# Altium schematic sheet GD.SchDoc
size A3; SheetNumber: 4; SheetTotal: 4
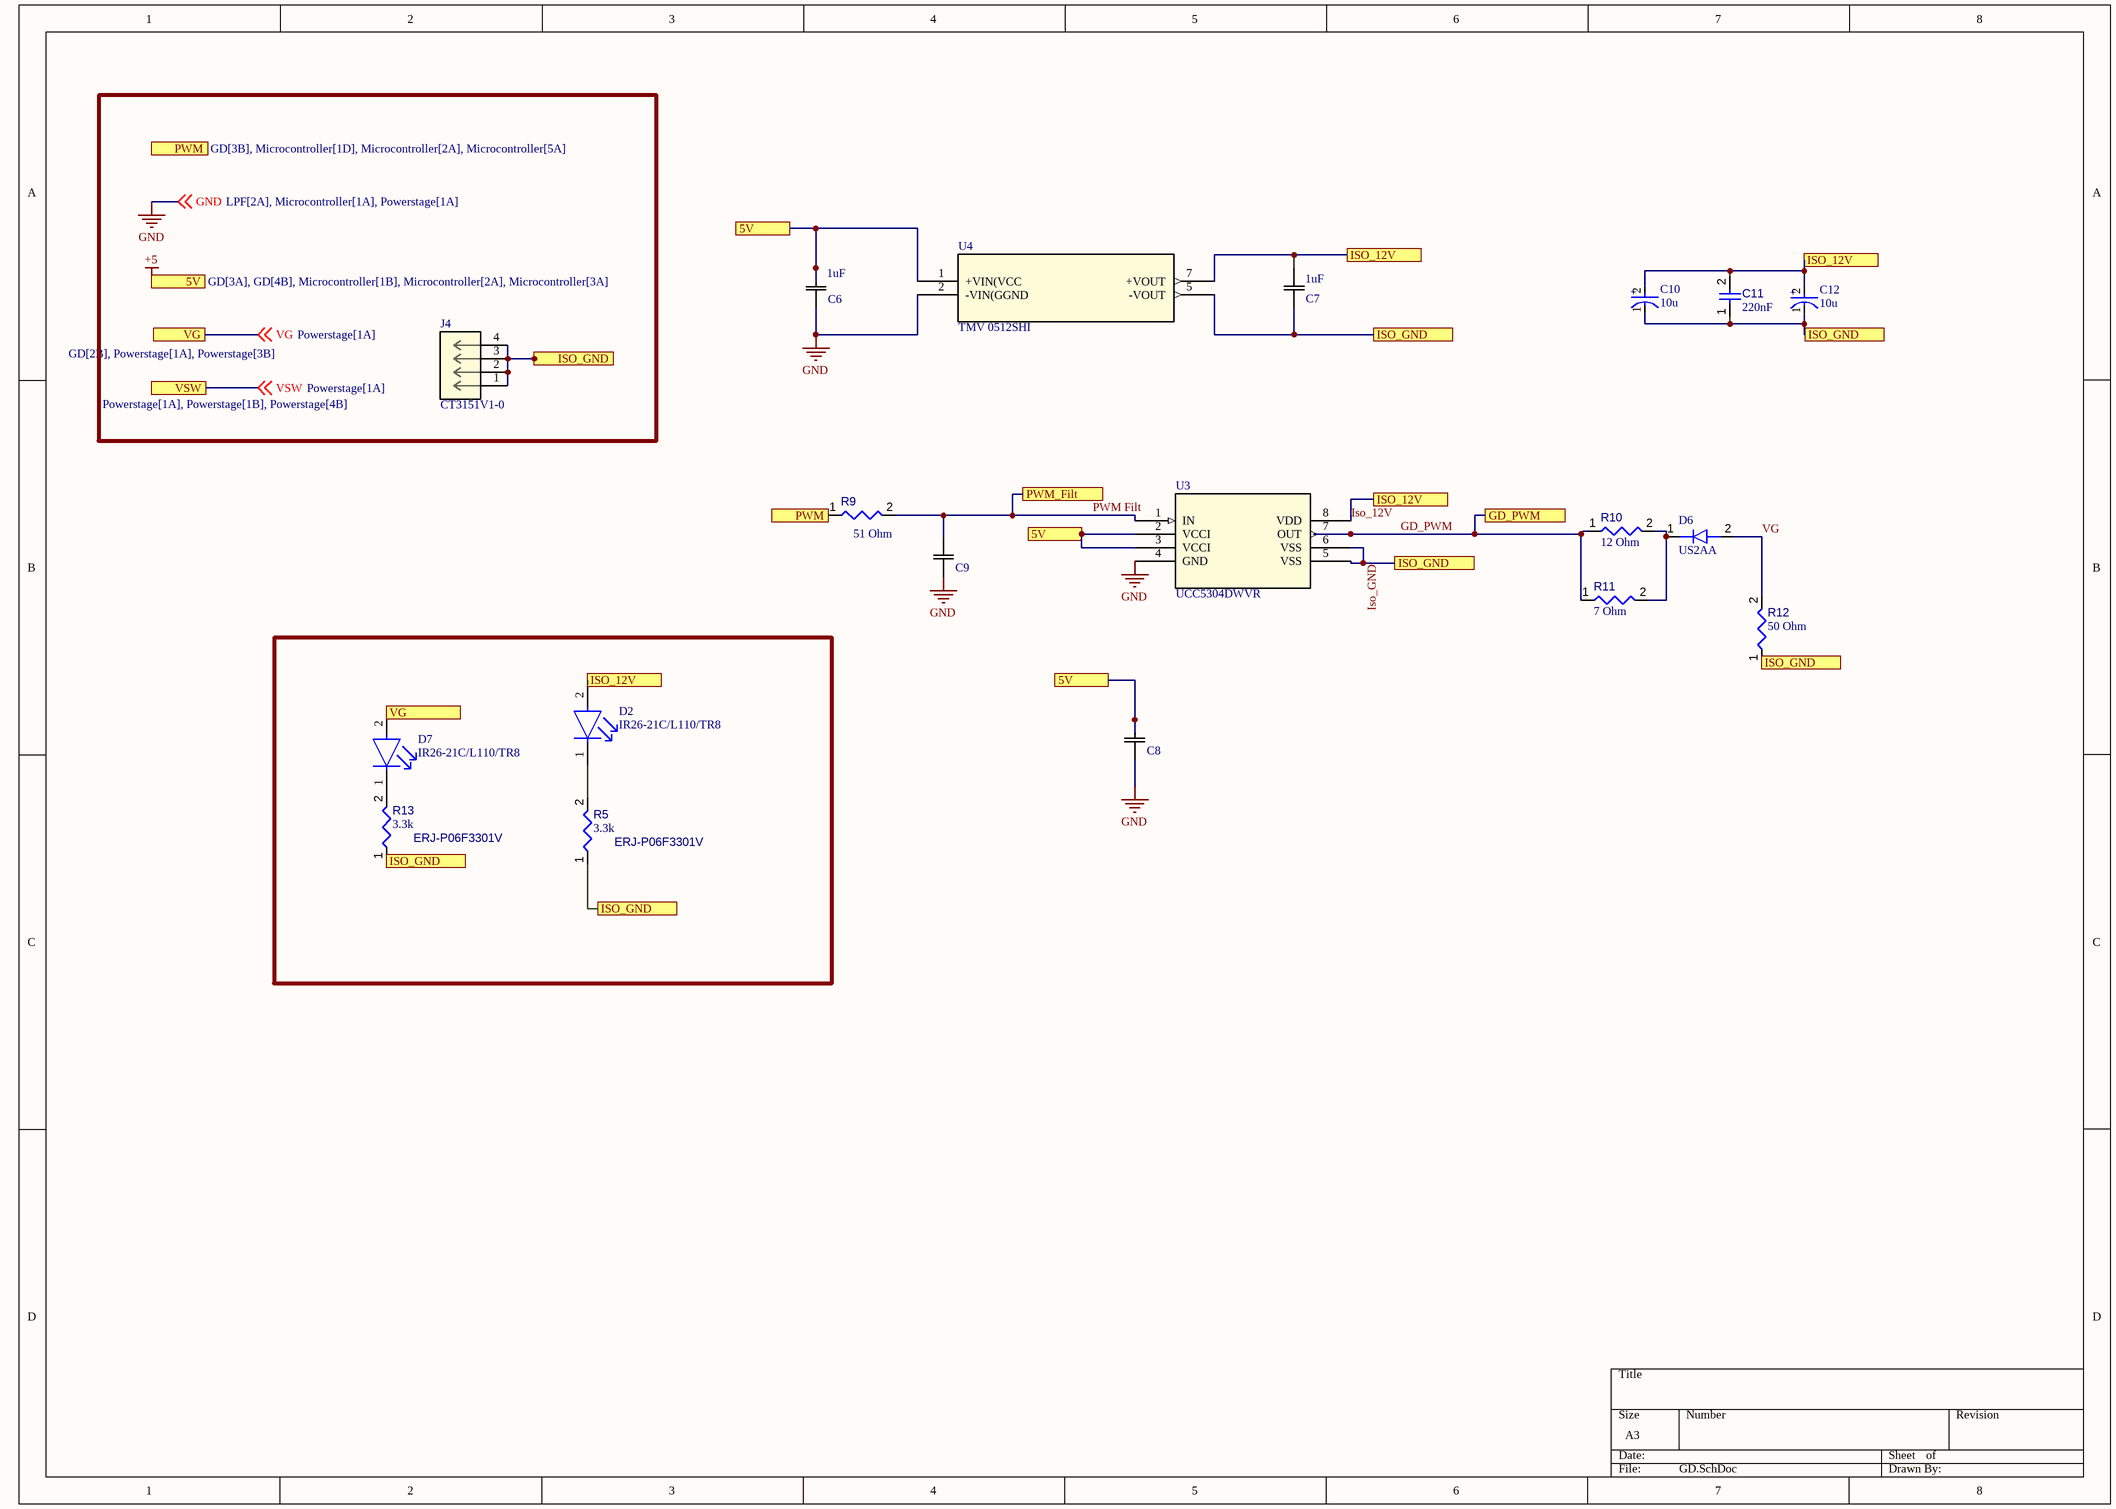
[diagram p0: GD.SchDoc]

## Parts
C6  1uF  [CAP_TMCHPTMCP_VIS]
C7  1uF  [CAP_TMCHPTMCP_VIS]
C8  TMCP1D105MTRF  [CAP_TMCHPTMCP_VIS]  (value not drawn)
C9  C0805C330J1GACAUTO  [CAPC220145_88N_KEM]  (value not drawn)
C10  10u  [FP-TAJA-MFG]
C11  value 220nF  [CAPC2113X120X50ML20T30]  (hidden comment: TAJR224K025RNJ)
C12  10u  [FP-TAJA-MFG]
D2  IR26-21C/L110/TR8  [FP-APTD3216CGCK-MFG]
D6  US2AA  [SMA_ONS]
D7  IR26-21C/L110/TR8  [FP-APTD3216CGCK-MFG]
J4  CT3151V1-0  [CON4_CT3151V1-0_CTE]
R5  ERJ-P06F3301V  value 3.3k  [RESC0805(2012)_L]
R9  value 51 Ohm  [RESC0805(2012)_L]  (hidden comment: ERJ-P06F3301V)
R10  value 12 Ohm  [RESC0805(2012)_L]  (hidden comment: ERJ-P06F3301V)
R11  value 7 Ohm  [RESC0805(2012)_L]  (hidden comment: ERJ-P06F3301V)
R12  value 50 Ohm  [RESC0805(2012)_L]  (hidden comment: ERJ-P06F3301V)
R13  ERJ-P06F3301V  value 3.3k  [RESC0805(2012)_L]
U3  UCC5304DWVR  [SOIC8_DWV_TEX]
U4  TMV 0512SHI  [TMV-HI_SINGLE_TRP]

## Ports
5V (see GD[1A], GD[3A], GD[4B], Microcontroller[1B], Microcontroller[2A], Microcontroller[3A]), 5V (see GD[1A], GD[4B], Microcontroller[1B], Microcontroller[2A], Microcontroller[3A]), 5V (see GD[3A], GD[4B], Microcontroller[1B], Microcontroller[2A], Microcontroller[3A]), GD_PWM, ISO_12V (see GD[3B], GD[6A], GD[6B]), ISO_12V (see GD[3B], GD[6A], GD[7A]), ISO_12V (see GD[3B], GD[6B], GD[7A]), ISO_12V (see GD[6A], GD[6B], GD[7A]), ISO_GND (see GD[2A], GD[2C], GD[3C], GD[6A], GD[6B], GD[7A]), ISO_GND (see GD[2A], GD[2C], GD[3C], GD[6A], GD[6B], GD[7B]), ISO_GND (see GD[2A], GD[2C], GD[3C], GD[6A], GD[7A], GD[7B]), ISO_GND (see GD[2A], GD[2C], GD[3C], GD[6B], GD[7A], GD[7B]), ISO_GND (see GD[2A], GD[2C], GD[6A], GD[6B], GD[7A], GD[7B]), ISO_GND (see GD[2A], GD[3C], GD[6A], GD[6B], GD[7A], GD[7B]), ISO_GND (see GD[2C], GD[3C], GD[6A], GD[6B], GD[7A], GD[7B]), PWM (see GD[1A], Microcontroller[1D], Microcontroller[2A], Microcontroller[5A]), PWM (see GD[3B], Microcontroller[1D], Microcontroller[2A], Microcontroller[5A]), PWM_Filt, VG (see GD[1A], Powerstage[1A], Powerstage[3B]), VG (see GD[2B], Powerstage[1A], Powerstage[3B]), VSW (see Powerstage[1A], Powerstage[1B], Powerstage[4B])

## Nets
+5: C6.2 C8.2 U3.2(VCCI) U3.3(VCCI) U4.1(+VIN(VCC) ; port 5V
GND: C6.1 C8.1 C9.1 U3.4(GND) U4.2(-VIN(GGND) ; off-sheet GND
GD_PWM: R10.1 R11.1 U3.7(OUT) ; port GD_PWM
Iso_12V: C7.2 C10.2(A) C11.2 C12.2(A) D2.2(A) U3.8(VDD) U4.7(+VOUT) ; port ISO_12V
Iso_GND: C7.1 C10.1(C) C11.1 C12.1(C) J4.1 J4.2 J4.3 J4.4 R5.1 R12.1 R13.1 U3.5(VSS) U3.6(VSS) U4.5(-VOUT) ; port ISO_GND
PWM: R9.1 ; port PWM
PWM Filt: C9.2 R9.2 U3.1(IN) ; port PWM_Filt
VG: D6.2(A) D7.2(A) R12.2 ; off-sheet VG, port VG
VSW: off-sheet VSW, port VSW
NetD2_1: D2.1(C) R5.2
NetD6_1: D6.1(K) R10.2 R11.2
NetD7_1: D7.1(C) R13.2

## Notes on the sheet
- (in symbol CMP-04424-000374-1) +

## Library data of the parts
C6 C7 = CMP-001-00110-1: TMCP1D105MTRF; Mfr_Name: Vishay; Design Item ID: TMCP1D105MTRF; Source: TMCP1D105MTRF.SchLib
C8 = CMP-001-00110-1: No Description Available; Mfr_Name: Vishay; Design Item ID: TMCP1D105MTRF; Source: TMCP1D105MTRF.SchLib
C9 = CMP-001-00109-1: No Description Available; Mfr_Name: Kemet; Source: C0805C330J1GACAUTO.SchLib; Design Item ID: C0805C330J1GACAUTO
C10 C12 = CMP-04424-000374-1: 10uF 25V  ±10% 8Ω 1206  SMD Tantalum Capacitor F951C106MPAAQ2; ESR (Equivalent Series Resistance): 8R; Leakage Current: 500nA; Dissipation Factor: 4%; Polarity: Polar; Tolerance: 20%; Capacitance: 1uF; Dielectric: X7R; Termination: SMD/SMT; Series: TAJ; Depth: 1.6mm; Voltage Rating (DC): 25V; RoHS Compliant: Yes; Number of Pins: 2; Mount: Surface Mount; Case/Package: 1206; Features: General Purpose; Length: 3.2mm; Height - Seated (Max): 0.071inch; Dielectric Material: Tantalum; Width: 1.6mm; Case Code (Metric): 3216; Min Operating Temperature: -55°C; Max Operating Temperature: 125°C; Radiation Hardening: No; Construction: Flat; Voltage: 25V; Height: 1.6mm; Package Quantity: 1; REACH SVHC: No SVHC; Packaging: Tape and Reel; Voltage Rating: 25V; Case Code (Imperial): 1206; Lead Free: Lead Free; Weight: 0.000571oz
C11 = CMP-001-00111-1: Tantalum Capacitor, Polarized, Tantalum (dry/solid), 25V, 10% +Tol, 10% -Tol, 0.22uF, Surface Mount, 0805; ESR (Equivalent Series Resistance): 21R; Tan Delta: 0.04; Leakage Current: 500nA; Length: 2.05mm; Packaging: Tape and Reel; Polarity: Polarized; Capacitor Type: Tantalum; Min Operating Temperature: -55°C; Width: 1.3mm; Mounting Technology: Surface Mount; Dielectric Material: Tantalum; Rated DC Voltage (URdc): 25V; Terminal Finish: Nickel; Package Style: SMTMeter; Termination: J BEND; Tolerance  (fill in as +-): 10%; Package Shape: Rectangular; Case/Package: 0805; Reach SVHC Compliant: Yes; Height: 1.2mm; RoHS Compliant: Yes; Tolerance (fill in as +-): 10%; JESD-609 Code: e3; Pins: 2; Max Operating Temperature: 125°C
D2 D7 = CMP-2000-05792-2: LED GREEN CLEAR 2SMD; Forward Voltage: 2.1V; Forward Current: 20mA; Luminous Intensity: 300mcd; Number of LEDs: 1; Dominant Wavelength: 570nm; Viewing Angle: 50°; Lead Free: Lead Free; Lens Color: Clear; Mount: Surface Mount; Package Quantity: 2000; Height: 1.8mm; Number of Pins: 2; Test Current: 20mA; Case Code (Metric): 3216; Case/Package: 1206; Case Code (Imperial): 1206; Illumination Color: Green; Color: Green; Width: 1.6mm; Packaging: Tape and Reel; Min Operating Temperature: -40°C; Lens Style: Clear; Max Operating Temperature: 85°C; Length: 3.2mm
D6 = CMP-323-000000-2: No Description Available; Mfr_Name: onsemi; Type: Type; Design Item ID: US2AA; Source: US2AA.SchLib; RefDes: RefDes
J4 = CMP-261-000000-2: No Description Available; Mfr_Name: CAL TEST ELECTRONICS; RefDes: RefDes; Design Item ID: CT3151V1-0; Type: Type; Source: CT3151V1-0.SchLib
R5 R9-R13 = CMP-009-00076-5: 1K 0.125W 5% 0805 (2012 Metric)  SMD; Power: 125mW; Tolerance: 5%; Case/Package: 0805; Mounting Technology: SMT; Pins: 2
U3 = CMP-303-000002-1: No Description Available; Mfr_Name: Texas Instruments; Source: UCC5304DWVR.SchLib; RefDes: RefDes; Type: Type; Design Item ID: UCC5304DWVR
U4 = CMP-01539-51129752-1: TMV 0512SHI Iso DC-DC Converter; Vin 4.5 to 5.5Vdc; Vout 12Vdc; I/O isolation 5200Vdc; Efficiency: 77%; Output Current: 84mA; Output Voltage: 12V; Isolation Voltage: 5.2kV; Number of Outputs: 1; Output Power: 1W; Min Operating Temperature: -40°C; RoHS: Compliant; Length: 19.5mm; Mount: Through Hole; Width: 7.5mm; Max Operating Temperature: 85°C; NexarPartId: 51129752; Height: 10.2mm; Depth: 10.2mm